# Altium schematic sheet 电源拓扑.SchDoc
size A2
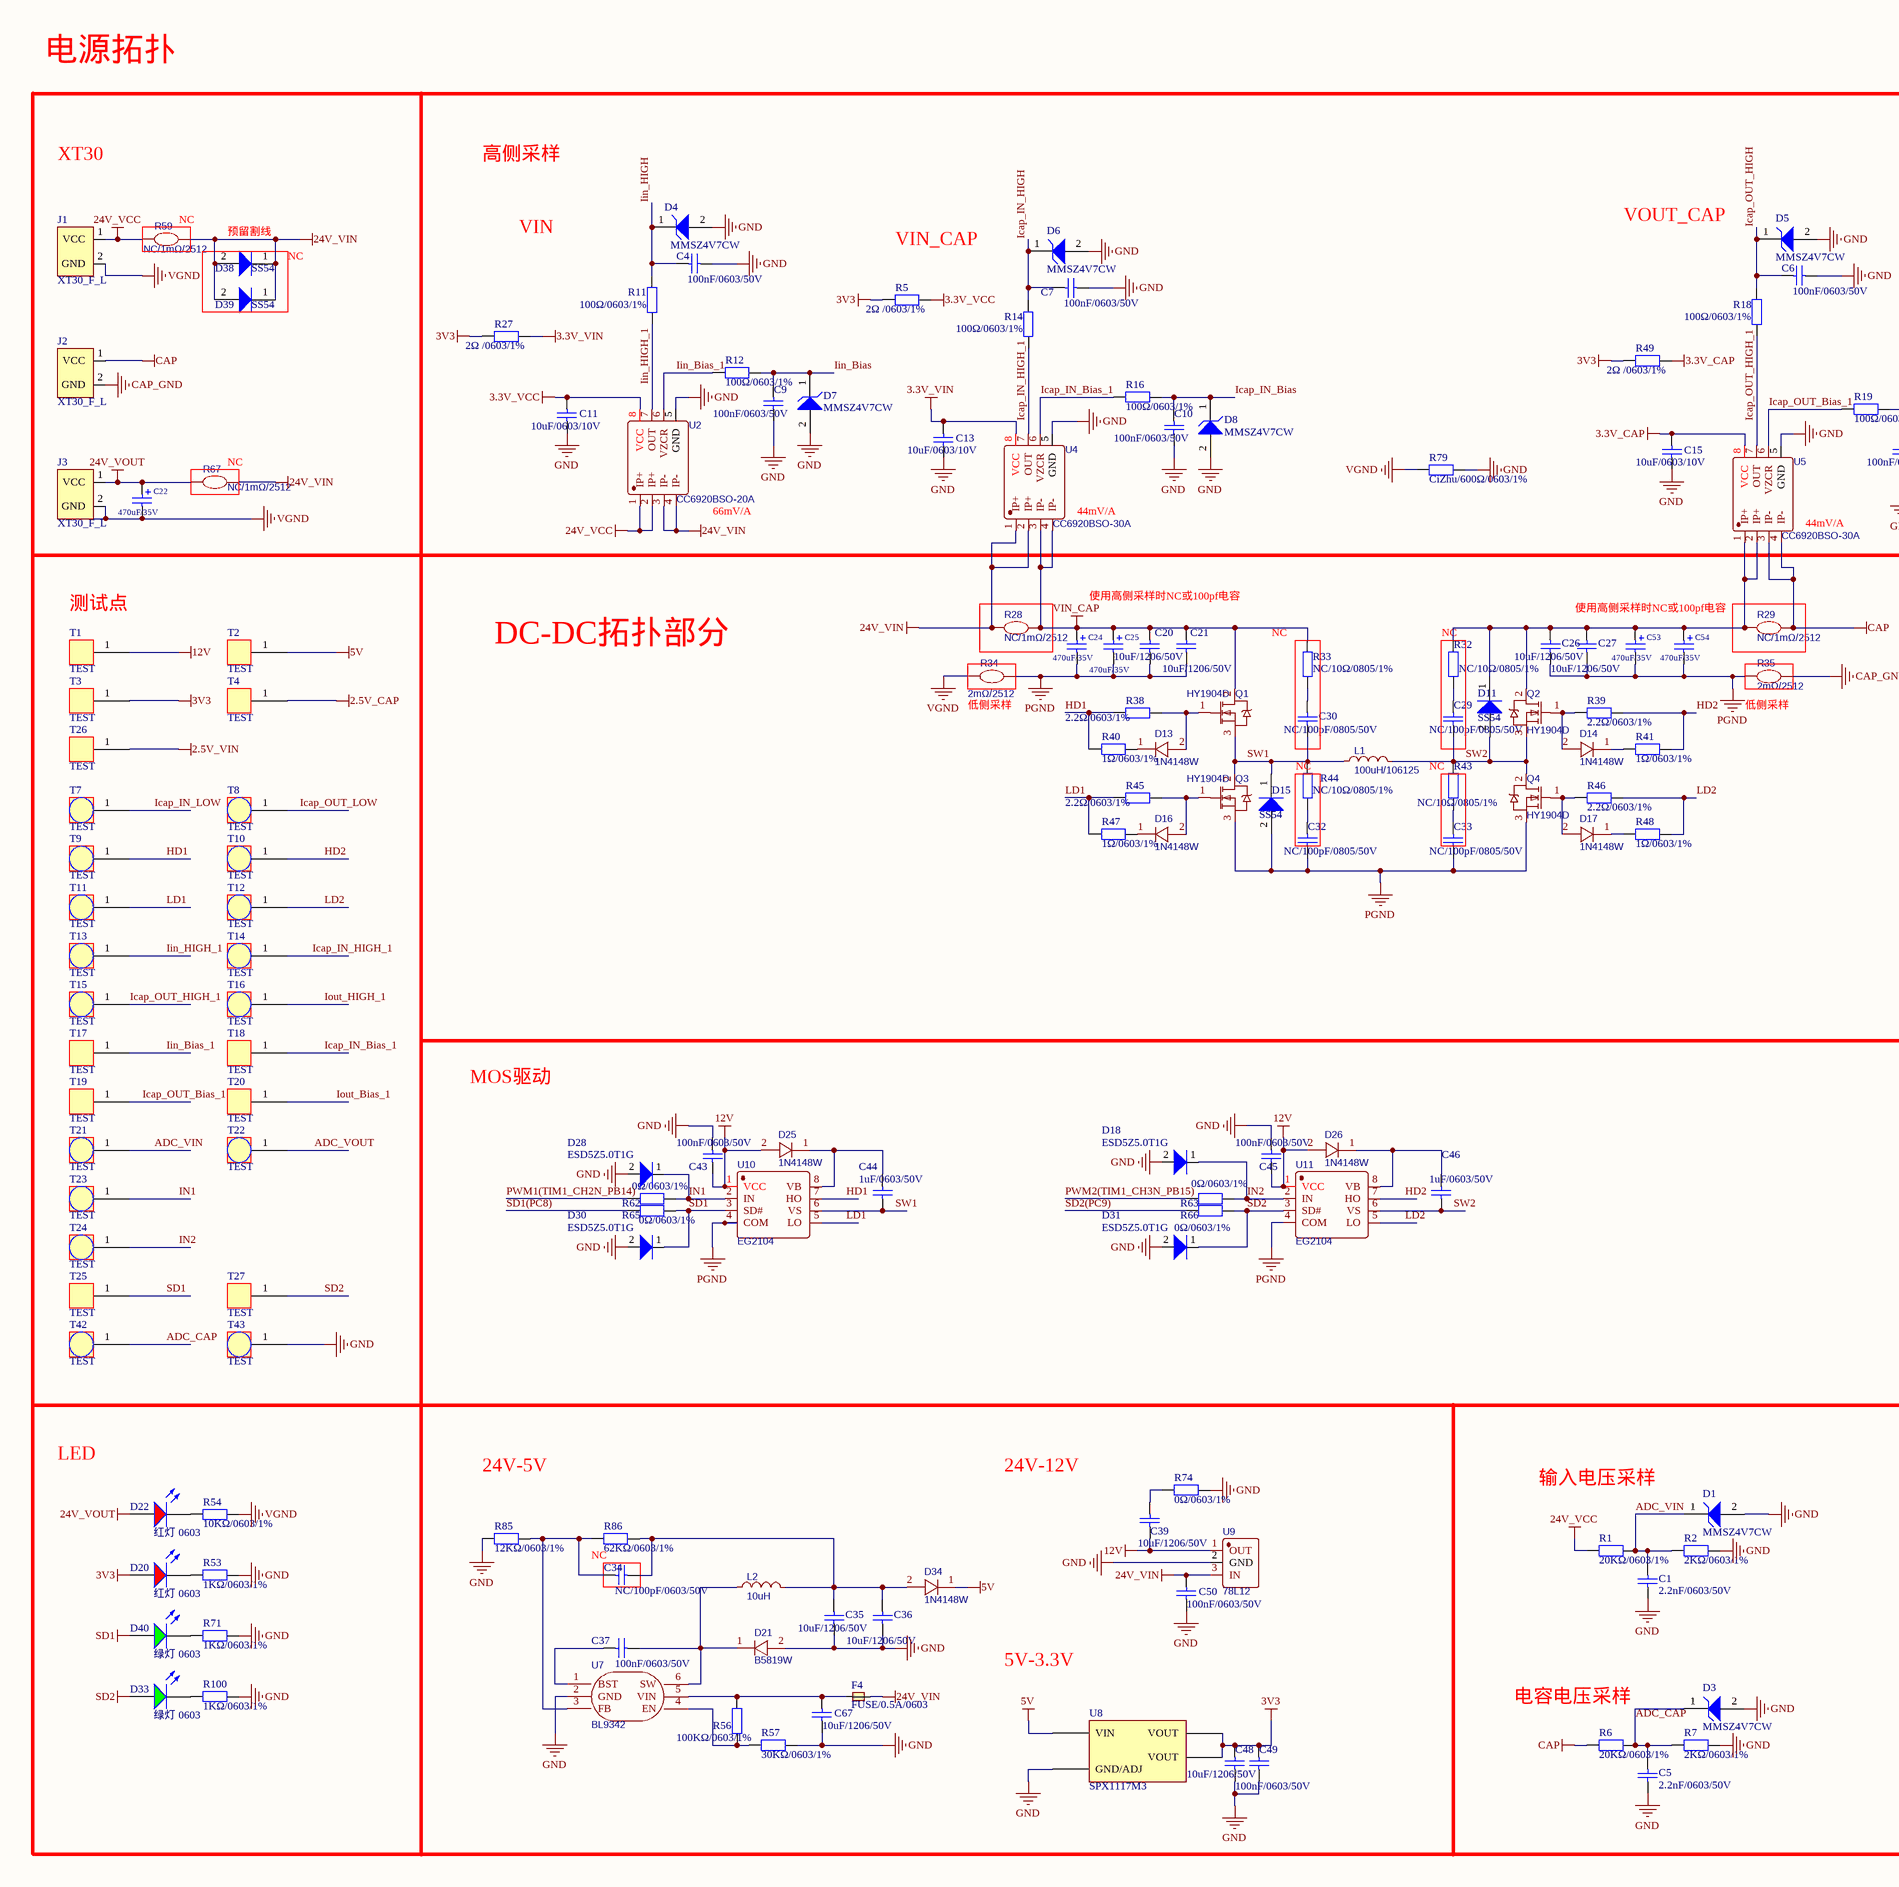
[diagram p0: 电源拓扑.SchDoc, left]
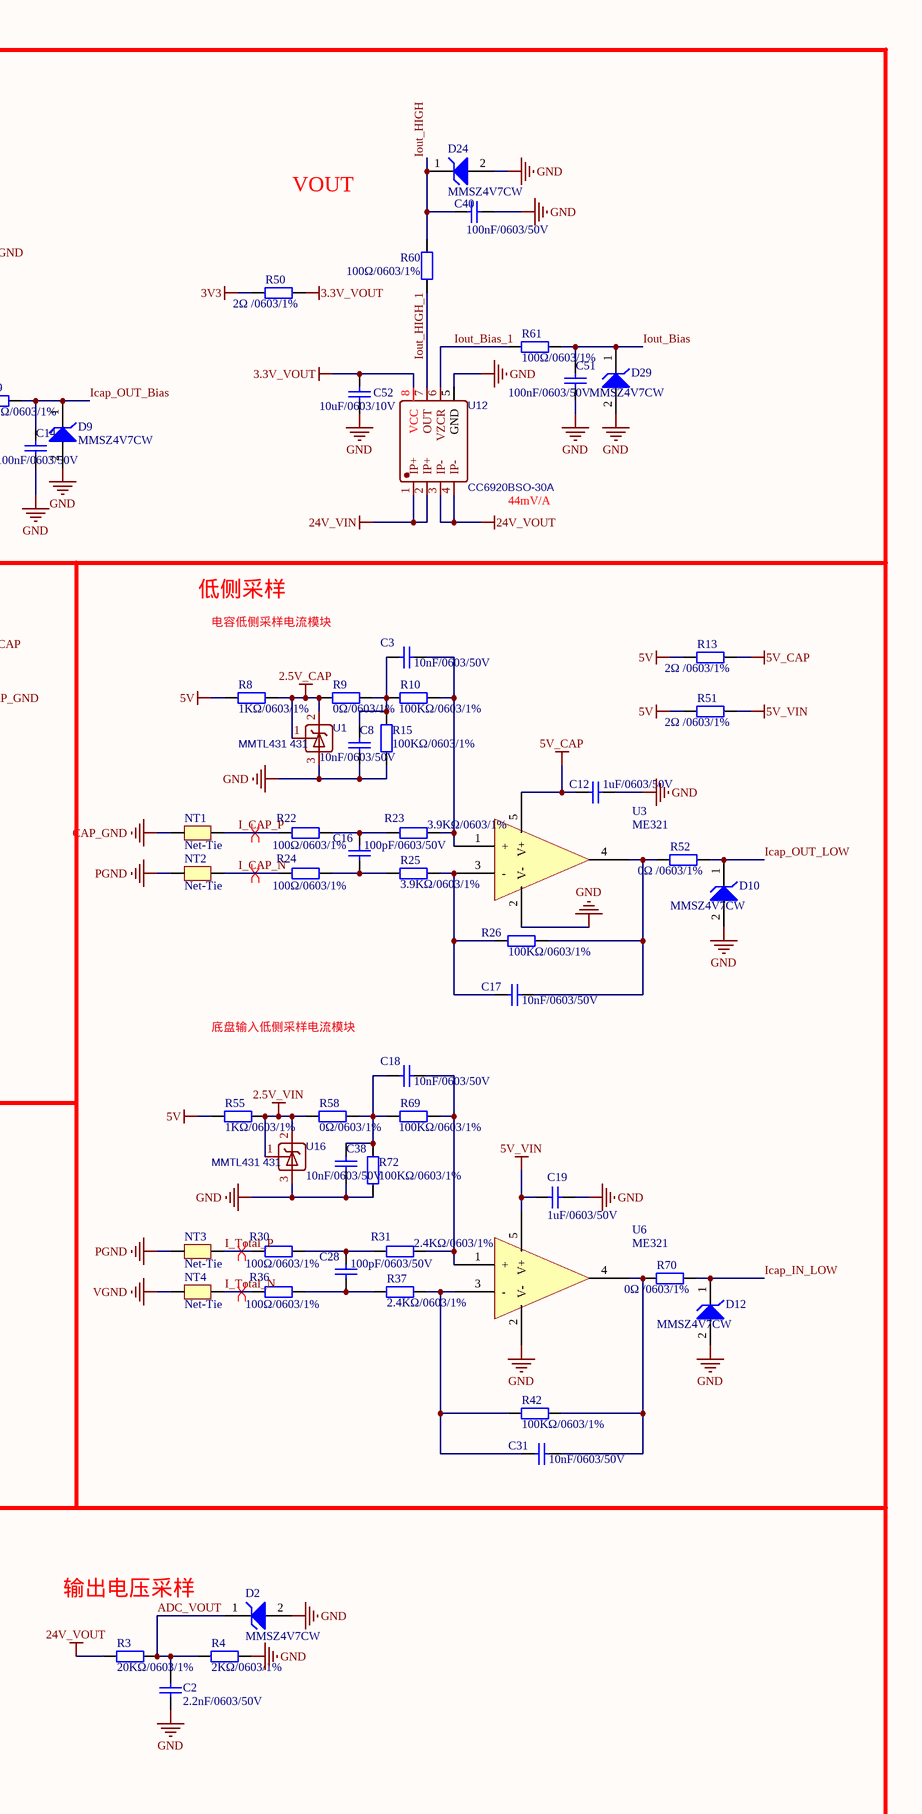
[diagram p1: 电源拓扑.SchDoc, right]

## Parts
C1  2.2nF/0603/50V  [0603_C]
C2  2.2nF/0603/50V  [0603_C]
C3  10nF/0603/50V  [0603_C]
C4  100nF/0603/50V  [0603_C]
C5  2.2nF/0603/50V  [0603_C]
C6  100nF/0603/50V  [0603_C]
C7  100nF/0603/50V  [0603_C]
C8  10nF/0603/50V  [0603_C]
C9  100nF/0603/50V  [0603_C]
C10  100nF/0603/50V  [0603_C]
C11  10uF/0603/10V  [0603_C]
C12  1uF/0603/50V  [0603_C]
C13  10uF/0603/10V  [0603_C]
C14  100nF/0603/50V  [0603_C]
C15  10uF/0603/10V  [0603_C]
C16  100pF/0603/50V  [0603_C]
C17  10nF/0603/50V  [0603_C]
C18  10nF/0603/50V  [0603_C]
C19  1uF/0603/50V  [0603_C]
C20  10uF/1206/50V  [1206_C]
C21  10uF/1206/50V  [1206_C]
C22  470uF/35V  [CAP_10x16mm]
C24  470uF/35V  [CAP_10x16mm]
C25  470uF/35V  [CAP_10x16mm]
C26  10uF/1206/50V  [1206_C]
C27  10uF/1206/50V  [1206_C]
C28  100pF/0603/50V  [0603_C]
C29  NC/100pF/0805/50V  [0805_C]
C30  NC/100pF/0805/50V  [0805_C]
C31  10nF/0603/50V  [0603_C]
C32  NC/100pF/0805/50V  [0805_C]
C33  NC/100pF/0805/50V  [0805_C]
C34  NC/100pF/0603/50V  [0603_C]
C35  10uF/1206/50V  [1206_C]
C36  10uF/1206/50V  [1206_C]
C37  100nF/0603/50V  [0603_C]
C38  10nF/0603/50V  [0603_C]
C39  10uF/1206/50V  [1206_C]
C40  100nF/0603/50V  [0603_C]
C43  100nF/0603/50V  [0603_C]
C44  1uF/0603/50V  [0603_C]
C45  100nF/0603/50V  [0603_C]
C46  1uF/0603/50V  [0603_C]
C48  100nF/0603/50V  [0603_C]
C49  10uF/1206/50V  [1206_C]
C50  100nF/0603/50V  [0603_C]
C51  100nF/0603/50V  [0603_C]
C52  10uF/0603/10V  [0603_C]
C53  470uF/35V  [CAP_10x16mm]
C54  470uF/35V  [CAP_10x16mm]
C67  10uF/1206/50V  [1206_C]
D1  MMSZ4V7CW  [SOD-123]
D2  MMSZ4V7CW  [SOD-123]
D3  MMSZ4V7CW  [SOD-123]
D4  MMSZ4V7CW  [SOD-123]
D5  MMSZ4V7CW  [SOD-123]
D6  MMSZ4V7CW  [SOD-123]
D7  MMSZ4V7CW  [SOD-123]
D8  MMSZ4V7CW  [SOD-123]
D9  MMSZ4V7CW  [SOD-123]
D10  MMSZ4V7CW  [SOD-123]
D11  SS54  [SMA]
D12  MMSZ4V7CW  [SOD-123]
D13  1N4148W  [SOD-123_L2.7-W1.6-LS3.7-RD]
D14  1N4148W  [SOD-123_L2.7-W1.6-LS3.7-RD]
D15  SS54  [SMA]
D16  1N4148W  [SOD-123_L2.7-W1.6-LS3.7-RD]
D17  1N4148W  [SOD-123_L2.7-W1.6-LS3.7-RD]
D18  ESD5Z5.0T1G  [SOD-523]
D20  红灯 0603  [0603_LED_S1]
D21  B5819W  [SOD-123_L2.7-W1.6-LS3.7-RD]
D22  红灯 0603  [0603_LED_S1]
D24  MMSZ4V7CW  [SOD-123]
D25  1N4148W  [SOD-123_L2.7-W1.6-LS3.7-RD]
D26  1N4148W  [SOD-123_L2.7-W1.6-LS3.7-RD]
D28  ESD5Z5.0T1G  [SOD-523]
D29  MMSZ4V7CW  [SOD-123]
D30  ESD5Z5.0T1G  [SOD-523]
D31  ESD5Z5.0T1G  [SOD-523]
D33  绿灯 0603  [0603_LED_S1]
D34  1N4148W  [SOD-123_L2.7-W1.6-LS3.7-RD]
D38  SS54  [SMA]
D39  SS54  [SMA]
D40  绿灯 0603  [0603_LED_S1]
F4  FUSE/0.5A/0603  [0.5A/0603]
J1  XT30_F_L  [XT30内嵌无极性标识_F]
J2  XT30_F_L  [XT30内嵌无极性标识_F]
J3  XT30_F_L  [XT30内嵌无极性标识_F]
L1  100uH/106125  [106125]
L2  10uH  [IND-SMD_L5.0-W5.0-1]
NT1  Net-Tie  [Net_Tie_10mil]
NT2  Net-Tie  [Net_Tie_10mil]
NT3  Net-Tie  [Net_Tie_10mil]
NT4  Net-Tie  [Net_Tie_10mil]
Q1  HY1904D  [TO-252-2_L6.6-W6.1-P4.57-LS9.9-TL-CW]
Q2  HY1904D  [TO-252-2_L6.6-W6.1-P4.57-LS9.9-TL-CW]
Q3  HY1904D  [TO-252-2_L6.6-W6.1-P4.57-LS9.9-TL-CW]
Q4  HY1904D  [TO-252-2_L6.6-W6.1-P4.57-LS9.9-TL-CW]
R1  20KΩ/0603/1%  [0603_R]
R2  2KΩ/0603/1%  [0603_R]
R3  20KΩ/0603/1%  [0603_R]
R4  2KΩ/0603/1%  [0603_R]
R5  2Ω /0603/1%  [0603_R]
R6  20KΩ/0603/1%  [0603_R]
R7  2KΩ/0603/1%  [0603_R]
R8  1KΩ/0603/1%  [0603_R]
R9  0Ω/0603/1%  [0603_R]
R10  100KΩ/0603/1%  [0603_R]
R11  100Ω/0603/1%  [0603_R]
R12  100Ω/0603/1%  [0603_R]
R13  2Ω /0603/1%  [0603_R]
R14  100Ω/0603/1%  [0603_R]
R15  100KΩ/0603/1%  [0603_R]
R16  100Ω/0603/1%  [0603_R]
R18  100Ω/0603/1%  [0603_R]
R19  100Ω/0603/1%  [0603_R]
R22  100Ω/0603/1%  [0603_R]
R23  3.9KΩ/0603/1%  [0603_R]
R24  100Ω/0603/1%  [0603_R]
R25  3.9KΩ/0603/1%  [0603_R]
R26  100KΩ/0603/1%  [0603_R]
R27  2Ω /0603/1%  [0603_R]
R28  NC/1mΩ/2512  [R2512]
R29  NC/1mΩ/2512  [R2512]
R30  100Ω/0603/1%  [0603_R]
R31  2.4KΩ/0603/1%  [0603_R]
R32  NC/10Ω/0805/1%  [0805_R]
R33  NC/10Ω/0805/1%  [0805_R]
R34  2mΩ/2512  [R2512]
R35  2mΩ/2512  [R2512]
R36  100Ω/0603/1%  [0603_R]
R37  2.4KΩ/0603/1%  [0603_R]
R38  2.2Ω/0603/1%  [0603_R]
R39  2.2Ω/0603/1%  [0603_R]
R40  1Ω/0603/1%  [0603_R]
R41  1Ω/0603/1%  [0603_R]
R42  100KΩ/0603/1%  [0603_R]
R43  NC/10Ω/0805/1%  [0805_R]
R44  NC/10Ω/0805/1%  [0805_R]
R45  2.2Ω/0603/1%  [0603_R]
R46  2.2Ω/0603/1%  [0603_R]
R47  1Ω/0603/1%  [0603_R]
R48  1Ω/0603/1%  [0603_R]
R49  2Ω /0603/1%  [0603_R]
R50  2Ω /0603/1%  [0603_R]
R51  2Ω /0603/1%  [0603_R]
R52  0Ω /0603/1%  [0603_R]
R53  1KΩ/0603/1%  [0603_R]
R54  10KΩ/0603/1%  [0603_R]
R55  1KΩ/0603/1%  [0603_R]
R56  100KΩ/0603/1%  [0603_R]
R57  30KΩ/0603/1%  [0603_R]
R58  0Ω/0603/1%  [0603_R]
R59  NC/1mΩ/2512  [R2512]
R60  100Ω/0603/1%  [0603_R]
R61  100Ω/0603/1%  [0603_R]
R62  0Ω/0603/1%  [0603_R]
R63  0Ω/0603/1%  [0603_R]
R65  0Ω/0603/1%  [0603_R]
R66  0Ω/0603/1%  [0603_R]
R67  NC/1mΩ/2512  [R2512]
R69  100KΩ/0603/1%  [0603_R]
R70  0Ω /0603/1%  [0603_R]
R71  1KΩ/0603/1%  [0603_R]
R72  100KΩ/0603/1%  [0603_R]
R74  0Ω/0603/1%  [0603_R]
R79  CiZhu/600Ω/0603/1%  [0603_R]
R85  12KΩ/0603/1%  [0603_R]
R86  62KΩ/0603/1%  [0603_R]
R100  1KΩ/0603/1%  [0603_R]
T1  TEST  [测试点]
T2  TEST  [测试点]
T3  TEST  [测试点]
T4  TEST  [测试点]
T7  TEST  [TEST_hole]
T8  TEST  [TEST_hole]
T9  TEST  [TEST_hole]
T10  TEST  [TEST_hole]
T11  TEST  [TEST_hole]
T12  TEST  [TEST_hole]
T13  TEST  [TEST_hole]
T14  TEST  [TEST_hole]
T15  TEST  [TEST_hole]
T16  TEST  [TEST_hole]
T17  TEST  [测试点]
T18  TEST  [测试点]
T19  TEST  [测试点]
T20  TEST  [测试点]
T21  TEST  [TEST_hole]
T22  TEST  [TEST_hole]
T23  TEST  [TEST_hole]
T24  TEST  [TEST_hole]
T25  TEST  [测试点]
T26  TEST  [测试点]
T27  TEST  [测试点]
T42  TEST  [TEST_hole]
T43  TEST  [TEST_hole]
U1  MMTL431 431  [SOT-23-3_L2.9-W1.6-P1.90-LS2.8-BR]
U2  CC6920BSO-20A  [SOP-8_L5.0-W4.0-P1.27-LS6.2-BL]
U3  ME321  [SOT-23（ME321）]
U4  CC6920BSO-30A  [SOP-8_L5.0-W4.0-P1.27-LS6.2-BL]
U5  CC6920BSO-30A  [SOP-8_L5.0-W4.0-P1.27-LS6.2-BL]
U6  ME321  [SOT-23（ME321）]
U7  BL9342  [SOT-23-6_L2.9-W1.6-P0.95-LS2.8-BR]
U8  SPX1117M3  [SOT-223]
U9  78L12  [SOT-89-3_L4.5-W2.5-P1.50-LS4.1-BL]
U10  EG2104  [SOIC-8_L4.9-W3.9-P1.27-LS6.0-BL]
U11  EG2104  [SOIC-8_L4.9-W3.9-P1.27-LS6.0-BL]
U12  CC6920BSO-30A  [SOP-8_L5.0-W4.0-P1.27-LS6.2-BL]
U16  MMTL431 431  [SOT-23-3_L2.9-W1.6-P1.90-LS2.8-BR]

## Blocks framed on the sheet
预留割线: D38 D39
NC: C29 R32

## Nets
2.5V_CAP: R8.1 R9.2 T4.1(VIN) U1.1(R) U1.2(K)
2.5V_VIN: R55.1 R58.2 T26.1(VIN) U16.1(R) U16.2(K)
3.3V_CAP: C15.2 R49.2 U5.8(VCC)
3.3V_VCC: C11.2 R5.2 U2.8(VCC)
3.3V_VIN: C13.2 R27.2 U4.8(VCC)
3.3V_VOUT: C52.2 R50.2 U12.8(VCC)
3V3: C48.1 C49.2 D20.A R5.1 R27.1 R49.1 R50.1 T3.1(VIN) U8.2(VOUT) U8.4(VOUT)
5V: D34.1(K) R8.2 R13.1 R51.1 R55.2 T2.1(VIN) U8.3(VIN)
5V_CAP: C12.1 R13.2 U3.5(V+)
5V_VIN: C19.2 R51.2 U6.5(V+)
12V: C39.1 C43.2 C45.2 D25.2(A) D26.2(A) T1.1(VIN) U9.1(OUT) U10.1(VCC) U11.1(VCC)
24V_VCC: J1.1(VCC) R1.2 R59.2 U2.1(IP+) U2.2(IP+)
24V_VIN: C50.1 D38.1(K) D38.2(A) D39.1(K) D39.2(A) F4.2 R28.2 R59.1 R67.1 U2.3(IP-) U2.4(IP-) U4.1(IP+) U4.2(IP+) U9.3(IN) U12.1(IP+) U12.2(IP+)
24V_VOUT: C22.1 D22.A J3.1(VCC) R3.2 R67.2 U12.3(IP-) U12.4(IP-)
CAP: J2.1(VCC) R6.2 R29.1 U5.3(IP-) U5.4(IP-)
CAP_GND: J2.2(GND) NT1.1 R35.1
GND: C1.1 C2.1 C4.2 C5.1 C6.2 C7.2 C8.2 C9.1 C10.1 C11.1 C12.2 C13.1 C14.1 C15.1 C19.1 C35.1 C36.1 C38.2 C40.2 C43.1 C45.1 C48.2 C49.1 C50.2 C51.1 C52.1 C67.1 D1.2(A) D2.2(A) D3.2(A) D4.2(A) D5.2(A) D6.2(A) D7.2(A) D8.2(A) D9.2(A) D10.2(A) D12.2(A) D18.2(A) D21.2(A) D24.2(A) D28.2(A) D29.2(A) D30.2(A) D31.2(A) R2.1 R4.1 R7.1 R15.2 R53.1 R57.2 R71.1 R72.2 R74.1 R79.1 R85.1 R100.1 T43.1(VIN) U1.3(A) U2.5(GND) U3.2(V-) U4.5(GND) U5.5(GND) U6.2(V-) U7.2(GND) U8.1(GND/ADJ) U9.2(GND) U12.5(GND) U16.3(A)
PGND: C20.1 C21.1 C24.2 C25.2 C26.1 C27.1 C32.1 C33.1 C53.2 C54.2 D15.2(A) NT2.1 NT3.1 Q3.3(S) Q4.3(S) R34.1 R35.2 U10.4(COM) U11.4(COM)
SD1: D30.1(K) D40.A R65.1 T25.1(VIN) U10.3(SD#)
SD2: D31.1(K) D33.A R66.1 T27.1(VIN) U11.3(SD#)
VGND: C22.2 J1.2(GND) J3.2(GND) NT4.1 R34.2 R54.1 R79.2
VIN_CAP: C20.2 C21.2 C24.1 C25.1 Q1.2(D) R28.1 R33.2 U4.3(IP-) U4.4(IP-)
ADC_CAP: C5.2 D3.1(K) R6.1 R7.2 T42.1(VIN)
ADC_VIN: C1.2 D1.1(K) R1.1 R2.2 T21.1(VIN)
ADC_VOUT: C2.2 D2.1(K) R3.1 R4.2 T22.1(VIN)
HD1: R38.1 R40.1 T9.1(VIN) U10.7(HO)
HD2: R39.1 R41.1 T10.1(VIN) U11.7(HO)
I_CAP_N: NT2.2 R24.1
I_CAP_P: NT1.2 R22.1
I_Total_N: NT4.2 R36.1
I_Total_P: NT3.2 R30.1
Icap_IN_Bias: C10.2 D8.1(K) R16.1
Icap_IN_Bias_1: R16.2 T18.1(VIN) U4.6(VZCR)
Icap_IN_HIGH: C7.1 D6.1(K) R14.2
Icap_IN_HIGH_1: R14.1 T14.1(VIN) U4.7(OUT)
Icap_IN_LOW: D12.1(K) R70.2 T7.1(VIN)
Icap_OUT_Bias: C14.2 D9.1(K) R19.1
Icap_OUT_Bias_1: R19.2 T19.1(VIN) U5.6(VZCR)
Icap_OUT_HIGH: C6.1 D5.1(K) R18.2
Icap_OUT_HIGH_1: R18.1 T15.1(VIN) U5.7(OUT)
Icap_OUT_LOW: D10.1(K) R52.2 T8.1(VIN)
Iin_Bias: C9.2 D7.1(K) R12.1
Iin_Bias_1: R12.2 T17.1(VIN) U2.6(VZCR)
Iin_HIGH: C4.1 D4.1(K) R11.2
Iin_HIGH_1: R11.1 T13.1(VIN) U2.7(OUT)
IN1: D28.1(K) R62.1 T23.1(VIN) U10.2(IN)
IN2: D18.1(K) R63.1 T24.1(VIN) U11.2(IN)
Iout_Bias: C51.2 D29.1(K) R61.1
Iout_Bias_1: R61.2 T20.1(VIN) U12.6(VZCR)
Iout_HIGH: C40.1 D24.1(K) R60.2
Iout_HIGH_1: R60.1 T16.1(VIN) U12.7(OUT)
LD1: R45.1 R47.1 T11.1(VIN) U10.5(LO)
LD2: R46.1 R48.1 T12.1(VIN) U11.5(LO)
PWM1(TIM1_CH2N_PB14): R62.2
PWM2(TIM1_CH3N_PB15): R63.2
SD1(PC8): R65.2
SD2(PC9): R66.2
SW1: C30.1 C44.2 D15.1(K) L1.1 Q1.3(S) Q3.2(D) R44.2 U10.6(VS)
SW2: C29.1 C46.2 D11.2(A) L1.2 Q2.3(S) Q4.2(D) R43.2 U11.6(VS)
NetC3_1: C3.1 R10.1 R23.2 U3.1(+)
NetC3_2: C3.2 C8.1 R9.1 R10.2 R15.1
NetC16_1: C16.1 R24.2 R25.1
NetC16_2: C16.2 R22.2 R23.1
NetC17_1: C17.1 R26.1 R52.1 U3.4
NetC17_2: C17.2 R25.2 R26.2 U3.3(-)
NetC18_1: C18.1 R31.2 R69.1 U6.1(+)
NetC18_2: C18.2 C38.1 R58.1 R69.2 R72.1
NetC26_2: C26.2 C27.2 C53.1 C54.1 D11.1(K) Q2.2(D) R29.2 R32.2 U5.1(IP+) U5.2(IP+)
NetC28_1: C28.1 R36.2 R37.1
NetC28_2: C28.2 R30.2 R31.1
NetC29_2: C29.2 R32.1
NetC30_2: C30.2 R33.1
NetC31_1: C31.1 R42.1 R70.1 U6.4
NetC31_2: C31.2 R37.2 R42.2 U6.3(-)
NetC32_2: C32.2 R44.1
NetC33_2: C33.2 R43.1
NetC34_1: C34.1 R85.2 R86.1 U7.3(FB)
NetC34_2: C34.2 C35.2 C36.2 D34.2(A) L2.2 R86.2
NetC37_1: C37.1 U7.1(BST)
NetC37_2: C37.2 D21.1(K) L2.1 U7.6(SW)
NetC39_2: C39.2 R74.2
NetC44_1: C44.1 D25.1(K) U10.8(VB)
NetC46_1: C46.1 D26.1(K) U11.8(VB)
NetC67_2: C67.2 F4.1 R56.2 U7.5(VIN)
NetD13_1: D13.1(K) R40.2
NetD13_2: D13.2(A) Q1.1(G) R38.2
NetD14_1: D14.1(K) R41.2
NetD14_2: D14.2(A) Q2.1(G) R39.2
NetD16_1: D16.1(K) R47.2
NetD16_2: D16.2(A) Q3.1(G) R45.2
NetD17_1: D17.1(K) R48.2
NetD17_2: D17.2(A) Q4.1(G) R46.2
NetD20_K: D20.K R53.2
NetD22_K: D22.K R54.2
NetD33_K: D33.K R100.2
NetD40_K: D40.K R71.2
NetR56_1: R56.1 R57.1 U7.4(EN)

## Layout directives
differential pair: I_CAP_N, I_CAP_P, I_Total_N, I_Total_P

## Notes on the sheet
- 电源拓扑
- XT30
- 高侧采样
- (near R59) NC
- NC
- VIN
- VIN_CAP
- VOUT_CAP
- VOUT
- (near R67) NC
- (near U2) 66mV/A
- (near U4) 44mV/A
- 44mV/A
- (near U5) 44mV/A
- (near T1) 测试点
- 使用高侧采样时NC或100pf电容
- (near R33) NC
- 低侧采样
- 电容低侧采样电流模块
- DC-DC拓扑部分
- (near R34) 低侧采样
- (near R35) 低侧采样
- (near R44) NC
- (near R43) NC
- 底盘输入低侧采样电流模块
- MOS驱动
- LED
- 24V-5V
- 24V-12V
- 输入电压采样
- 输出电压采样
- 5V-3.3V
- (near R6) 电容电压采样

## Library data of the parts
C1-C10 C12 C14 C16-C18 C28 C31 C34 C37 C38 C40 C43-C46 C48 C50 C51 = 0603 100pF (101) 5% 50V: 贴片电容; ComponentLink1Description: 供应商链接; ComponentLink1URL: http://www.szlcsc.com/product/details_15530.html; Package: 0603; Supplier: LC; SuppliersPartNumber: C14858
C11 C13 C15 C19 C52 = 0603 10uF (106) 10% 10V: 贴片电容; ComponentLink1Description: 供应商链接; ComponentLink1URL: http://www.szlcsc.com/product/details_20411.html; Package: 0603; Supplier: LC; SuppliersPartNumber: C19702
C20 C21 C26 C27 C35 C36 C39 C49 C67 = 1206 10uF (106) 10% 50V: 贴片电容; ComponentLink1Description: 供应商链接; ComponentLink1URL: http://www.szlcsc.com/product/details_14236.html; Package: 1206; Supplier: LC; SuppliersPartNumber: C13585
C22 C24 C25 C53 C54 = CAP_470uF/35V/10x16mm: 铝电解电容
C29 C30 C32 C33 = 0805 100pF (101) 5% 50V: 贴片电容; ComponentLink1Description: 供应商链接; ComponentLink1URL: http://www.szlcsc.com/product/details_2142.html; Package: 0805; Supplier: LC; SuppliersPartNumber: C1790
D1-D10 D12 D24 D29 = LL-34 ZMM3V3: 稳压二极管; ComponentLink1Description: 供应商链接; ComponentLink1URL: http://www.szlcsc.com/product/details_8535.html; Package: LL-34; Supplier: LC; SuppliersPartNumber: C8056
D11 D15 D38 D39 = SS54: 二极管
D13 D14 D16 D17 D21 D25 D26 D34 = 1N4148W: 开关二极管; BOM_Manufacturer: High Diode; Contributor: LCSC; BOM_Supplier: LCSC; BOM_Supplier Part: C466653; BOM_Manufacturer Part: 1N4148W; BOM_JLCPCB Part Class: Extended Part; spicePre: D; spiceSymbolName: 1N4148W_C466653
D18 D28 D30 D31 = TVS_SOD-523: 单向TVS
D20 D22 = 0603 红灯: 发光二极管; ComponentLink1Description: 供应商链接; ComponentLink1URL: http://www.szlcsc.com/product/details_2659.html; Package: 0603; Supplier: LC; SuppliersPartNumber: C2286
D33 D40 = 0603 绿灯: 发光二极管; ComponentLink1Description: 供应商链接; ComponentLink1URL: http://www.szlcsc.com/product/details_73152.html; Package: 0603; Supplier: LC; SuppliersPartNumber: C72043
F4 = FUSE/0.5A/0603: FUSE; SuppliersPartNumber: C136319
J1-J3 = XT30_F_L: 卧式XT30
L1 = 106125 卧式: 磁环电感; BOM_Manufacturer: YJYCOIN; BOM_Manufacturer Part: YSPI1365-470M; nameAlias: Inductance; Contributor: LCSC; BOM_Supplier: LCSC; BOM_Supplier Part: C497913; BOM_JLCPCB Part Class: Extended Part; spicePre: L; spiceSymbolName: YSPI1365-470M
L2 = 15uH: 功率电感; BOM_Manufacturer: YJYCOIN; BOM_Manufacturer Part: YSPI1365-470M; nameAlias: Inductance; Contributor: LCSC; BOM_Supplier: LCSC; BOM_Supplier Part: C497913; BOM_JLCPCB Part Class: Extended Part; spicePre: L; spiceSymbolName: YSPI1365-470M
Q1-Q4 = HY1904D: BOM_Manufacturer: HOOYI; BOM_Supplier: LCSC; BOM_Manufacturer Part: HY1904D; BOM_Supplier Part: C122488; BOM_JLCPCB Part Class: Extended Part; spicePre: Q; spiceSymbolName: HY1904D
R1-R4 R6-R8 R10 R15 R53-R55 R69 R71 R72 R100 = 0603 10KΩ (1002) 1%: 贴片电阻; ComponentLink1Description: 供应商链接; ComponentLink1URL: http://www.szlcsc.com/product/details_26547.html; Package: 0603; Supplier: LC; SuppliersPartNumber: C25804
R5 R13 R27 R49-R52 R70 = 0603 2.2Ω (2R20) 1%: 贴片电阻; ComponentLink1Description: 供应商链接; ComponentLink1URL: http://www.szlcsc.com/product/details_23666.html; Package: 0603; Supplier: LC; SuppliersPartNumber: C22939
R9 R38-R41 R45-R48 R58 R62 R63 R65 R66 R74 R79 = 0603 0Ω (0R0) 1%: 贴片电阻; ComponentLink1Description: 供应商链接; ComponentLink1URL: http://www.szlcsc.com/product/details_21903.html; Package: 0603; Supplier: LC; SuppliersPartNumber: C21189
R11 R12 R14 R16 R18 R19 R22 R24 R30 R36 R60 R61 = 0603 100Ω (1000) 1%: 贴片电阻; ComponentLink1Description: 供应商链接; ComponentLink1URL: http://www.szlcsc.com/product/details_23502.html; Package: 0603; Supplier: LC; SuppliersPartNumber: C22775
R23 R25 R31 R37 = 0603 3.9KΩ (3901) 1%: 贴片电阻; ComponentLink1Description: 供应商链接; ComponentLink1URL: http://www.szlcsc.com/product/details_23745.html; Package: 0603; Supplier: LC; SuppliersPartNumber: C23018
R26 R42 = 0603 200KΩ (2003) 1%: 贴片电阻; ComponentLink1Description: 供应商链接; ComponentLink1URL: http://www.szlcsc.com/product/details_26554.html; Package: 0603; Supplier: LC; SuppliersPartNumber: C25811
R28 R29 R34 R35 R59 R67 = 0.01: 2512采样; BOM_Manufacturer: TA-I Tech; BOM_Manufacturer Part: RLP25FEGR010; nameAlias: Resistance (Ohms); Contributor: LCSC; BOM_Supplier: LCSC; BOM_Supplier Part: C393070; BOM_JLCPCB Part Class: Extended Part; spicePre: R; spiceSymbolName: RLP25FEGR010
R32 R33 R43 R44 = 0805 10Ω (10R0) 1%: 贴片电阻; ComponentLink1Description: 供应商链接; ComponentLink1URL: http://www.szlcsc.com/product/details_18103.html; Package: 0805; Supplier: LC; SuppliersPartNumber: C17415
R56 = 0603 100KΩ (1003) 1%: 贴片电阻; ComponentLink1Description: 供应商链接; ComponentLink1URL: http://www.szlcsc.com/product/details_26546.html; Package: 0603; Supplier: LC; SuppliersPartNumber: C25803
R57 = 0603 30KΩ (3002) 1%: 贴片电阻; ComponentLink1Description: 供应商链接; ComponentLink1URL: http://www.szlcsc.com/product/details_23711.html; Package: 0603; Supplier: LC; SuppliersPartNumber: C22984
R85 = 0603 12KΩ (1202) 1%: 贴片电阻; ComponentLink1Description: 供应商链接; ComponentLink1URL: http://www.szlcsc.com/product/details_23517.html; Package: 0603; Supplier: LC; SuppliersPartNumber: C22790
R86 = 0603 62KΩ (6202) 1%: 贴片电阻; ComponentLink1Description: 供应商链接; ComponentLink1URL: http://www.szlcsc.com/product/details_23948.html; Package: 0603; Supplier: LC; SuppliersPartNumber: C23221
T1-T4 T17-T20 T25-T27 = 测试点
T7-T16 T21-T24 T42 T43 = 测试孔
U1 U16 = MMTL431 431: BOM_Manufacturer: CBI(创基); Contributor: LCSC; BOM_Supplier: LCSC; BOM_Supplier Part: C2828456; BOM_Manufacturer Part: MMTL431 431; spicePre: U; spiceSymbolName: MMTL431 431
U2 U4 U5 U12 = CC6920SO-20A: BOM_Manufacturer: CrossChip(成都芯进); Contributor: LCSC; BOM_Supplier: LCSC; BOM_Supplier Part: C2760489; BOM_Manufacturer Part: CC6920SO-20A; BOM_JLCPCB Part Class: Extended Part; spicePre: U; spiceSymbolName: CC6920SO-20A
U3 U6 = ME321: 轨对轨运放
U7 = BL9342: BOM_Manufacturer: BL; BOM_Supplier: LCSC; BOM_Manufacturer Part: BL9342; BOM_Supplier Part: C93176; BOM_JLCPCB Part Class: Extended Part; spicePre: U; spiceSymbolName: BL9342
U8 = ZLDO1117: LDO SOT-223
U9 = 78L05_C2898658: LDO; BOM_Manufacturer: YFW佑风微; BOM_Manufacturer Part: 78L05; Contributor: LCSC; BOM_Supplier: LCSC; BOM_Supplier Part: C2898658; spicePre: U; spiceSymbolName: 78L05_C2898658
U10 U11 = IR2104STRPBF: BOM_Manufacturer: IR; spicePre: X; BOM_Supplier: LCSC; BOM_Manufacturer Part: IR2104STRPBF; BOM_Supplier Part: C2960; BOM_JLCPCB Part Class: Extended Part; spiceSymbolName: IR2104STRPBF